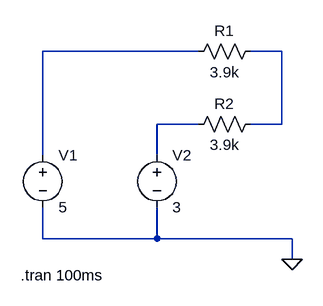
[diagram p0: schematic суматор.asc]
суматор.asc, the LTspice schematic file:
Version 4
SHEET 1 880 680
WIRE 240 -96 0 -96
WIRE 368 -96 320 -96
WIRE 240 16 176 16
WIRE 368 16 368 -96
WIRE 368 16 320 16
WIRE 0 64 0 -96
WIRE 176 64 176 16
WIRE 0 192 0 144
WIRE 176 192 176 144
WIRE 176 192 0 192
WIRE 384 192 176 192
WIRE 384 224 384 192
FLAG 384 224 0
SYMBOL res 336 -112 R90
WINDOW 0 0 56 VBottom 2
WINDOW 3 32 56 VTop 2
SYMATTR InstName R1
SYMATTR Value 3.9k
SYMBOL res 336 0 R90
WINDOW 0 0 56 VBottom 2
WINDOW 3 32 56 VTop 2
SYMATTR InstName R2
SYMATTR Value 3.9k
SYMBOL voltage 0 48 R0
SYMATTR InstName V1
SYMATTR Value 5
SYMBOL voltage 176 48 R0
SYMATTR InstName V2
SYMATTR Value 3
TEXT -34 248 Left 2 !.tran 100ms

The netlist it stands for:
* суматор.asc
R1 N002 N001 3.9k
R2 N002 N003 3.9k
V1 N001 0 5
V2 N003 0 3
.tran 100ms
.backanno
.end